# Altium schematic sheet signalIsolator.SchDoc
size A
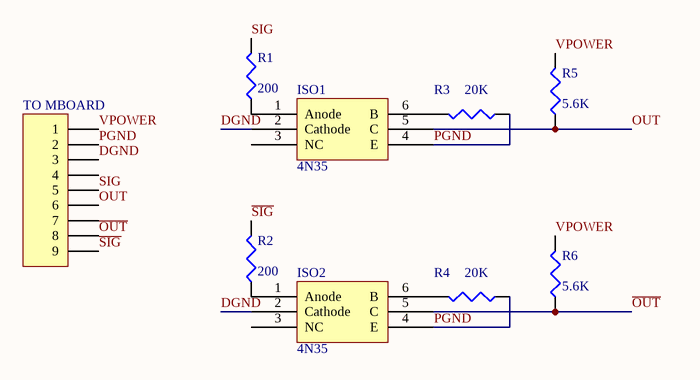
[diagram p0: signalIsolator.SchDoc]

## Parts
ISO1  4N35  [DIP6LGE]
ISO2  4N35  [DIP6LGE]
R1  value 200  [Res10mm_LGE1.0]  (hidden comment: -Res)
R2  value 200  [Res10mm_LGE1.0]
R3  value 20K  [Res10mm_LGE1.0]  (hidden comment: G-Res)
R4  value 20K  [Res10mm_LGE1.0]  (hidden comment: G-Res)
R5  value 5.6K  [Res10mm_LGE1.0]  (hidden comment: G-Res)
R6  value 5.6K  [Res10mm_LGE1.0]  (hidden comment: G-Res)
TO_MBOARD  (no value)  [HDR1X9_LGE1.0]

## Nets
DGND: ISO1.2(Cathode) ISO2.2(Cathode) TO_MBOARD.3
~{OUT}: ISO2.5(C) R6.1 TO_MBOARD.8
OUT: ISO1.5(C) R5.1 TO_MBOARD.6
PGND: ISO1.4(E) ISO2.4(E) R3.1 R4.1 TO_MBOARD.2
~{SIG}: R2.2 TO_MBOARD.9
SIG: R1.2 TO_MBOARD.5
VPOWER: R5.2 R6.2 TO_MBOARD.1
NetISO1_1: ISO1.1(Anode) R1.1
NetISO1_6: ISO1.6(B) R3.2
NetISO2_1: ISO2.1(Anode) R2.1
NetISO2_6: ISO2.6(B) R4.2

Not connected (* = marked no-connect by the designer): ISO1 3(NC); ISO2 3(NC); TO_MBOARD 4 7

## Library data of the parts
R1-R6 = G-Res: resistor (specify value); Published: 8-Jun-2000; LatestRevisionDate: 29-May-2009; LatestRevisionNote: IPC-7351 Footprint Added.; PackageReference: J1-0603; Publisher: Altium Limited; PackageDescription: Chip Resistor
TO_MBOARD = C-Hdr1x9: Header, 10-Pin; LatestRevisionDate: 17-Jul-2002; LatestRevisionNote: Re-released for DXP Platform.; Publisher: Altium Limited